# EAGLE design powerDist (EAGLE 6.6.0)
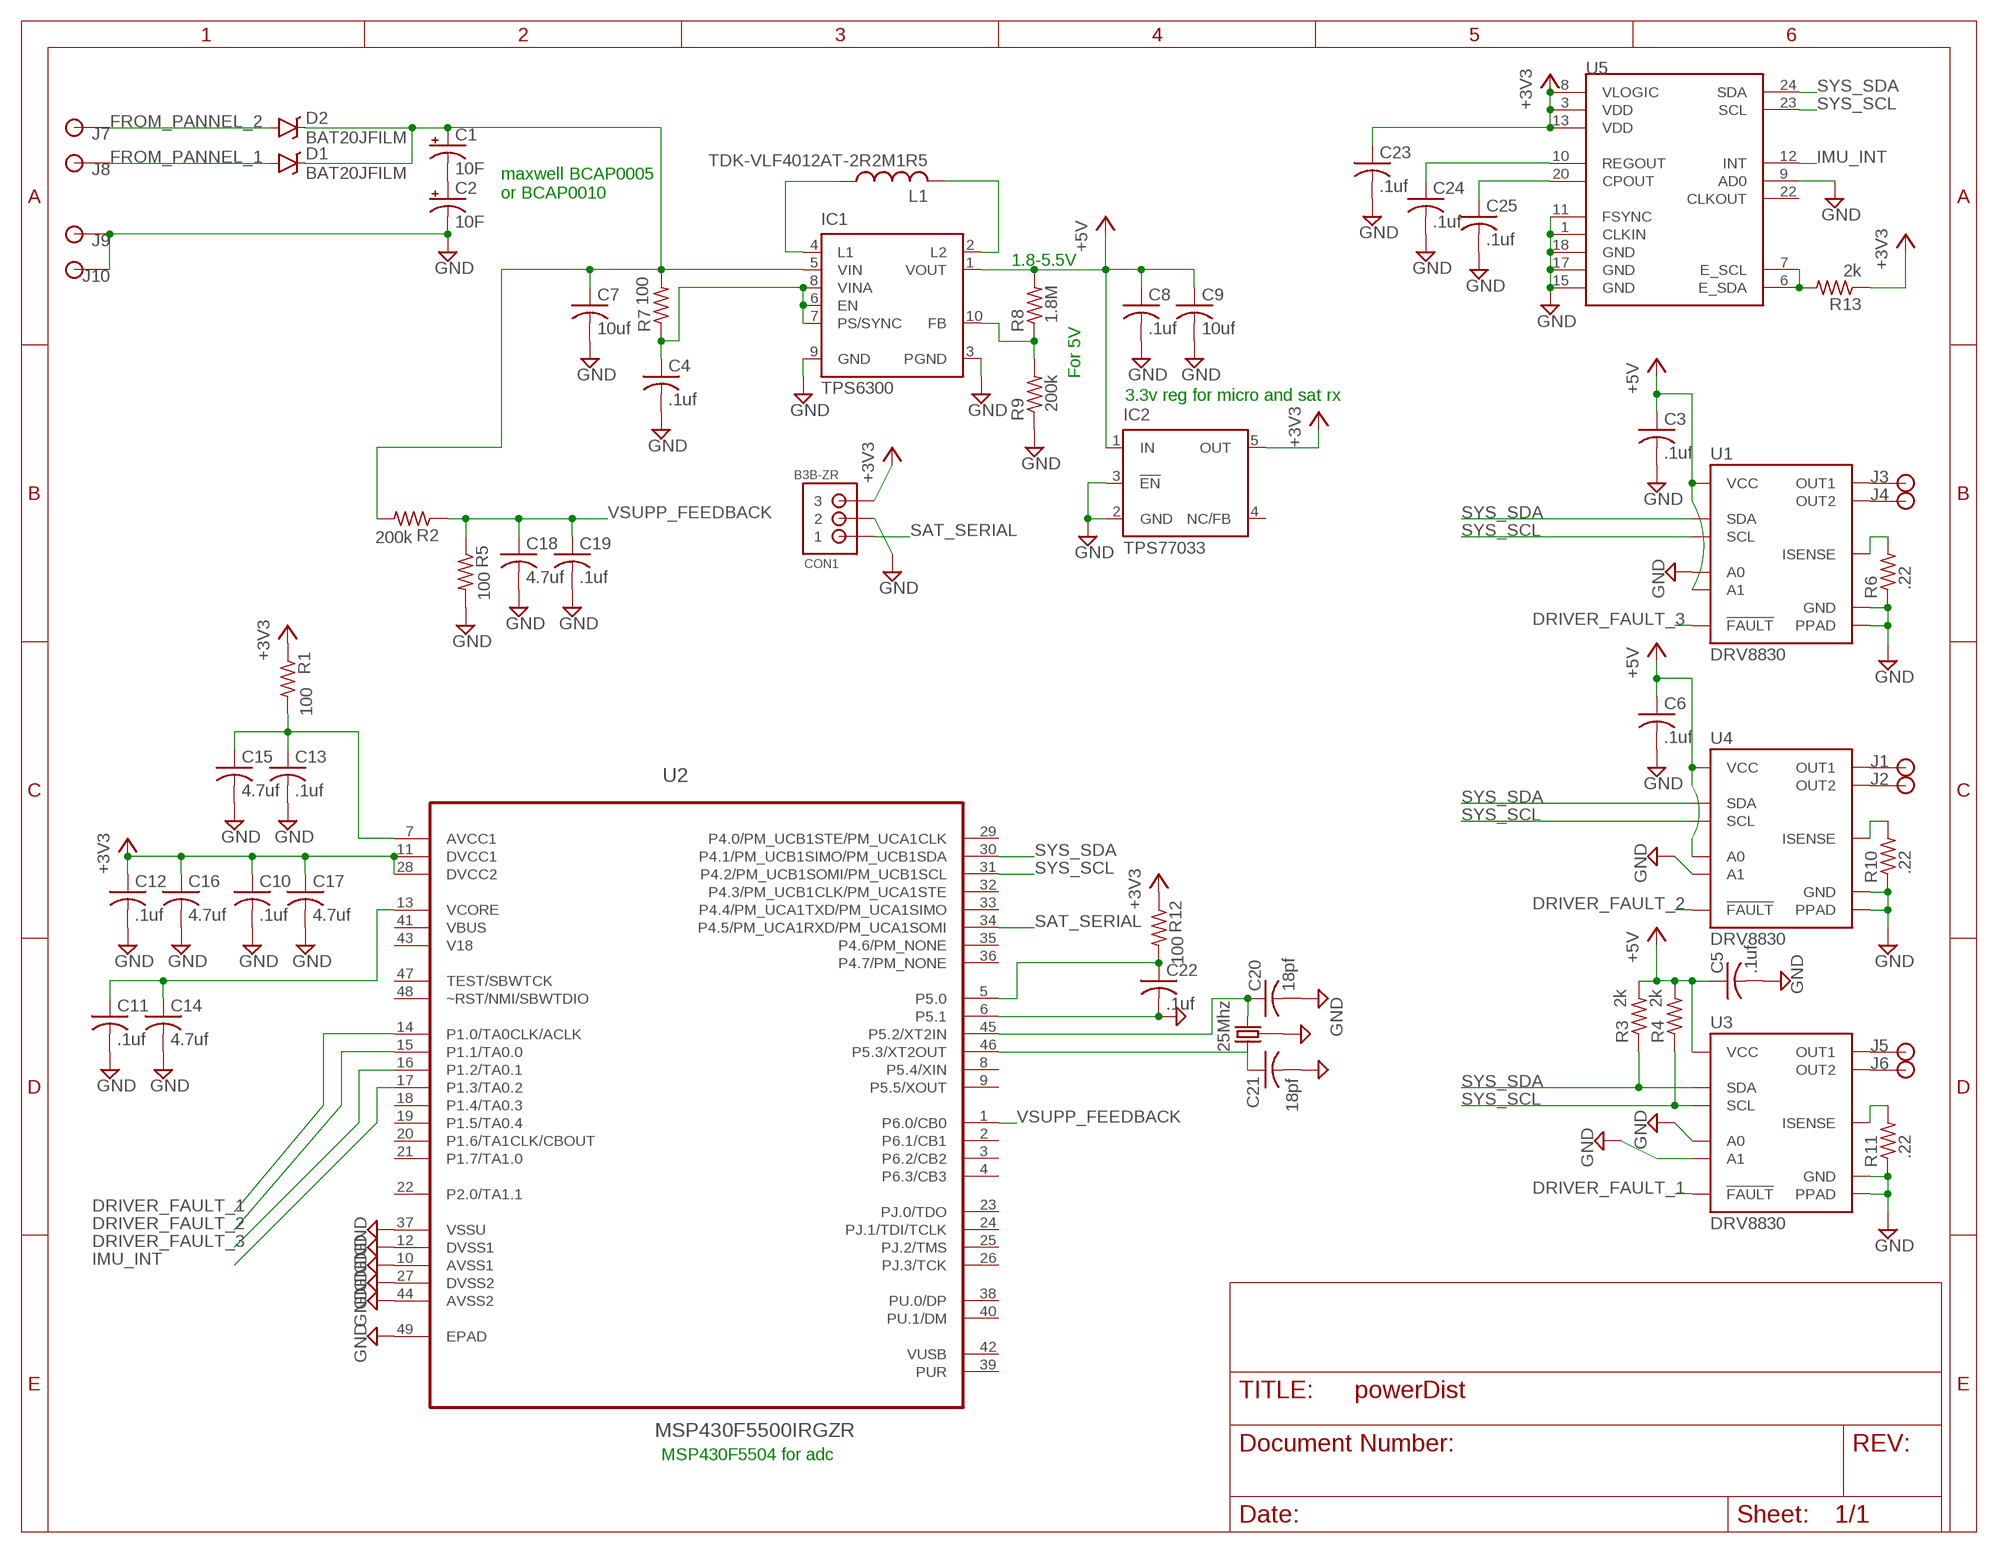
[diagram p0: schematic, sheet 1]

## Parts
C1  10F  CPOL-USE5-10.5  [E5-10,5]
C2  10F  CPOL-USE5-10.5  [E5-10,5]
C3  .1uf  C-USC0603  [C0603]
C4  .1uf  C-USC0603  [C0603]
C5  .1uf  C-USC0603  [C0603]
C6  .1uf  C-USC0603  [C0603]
C7  10uf  C-USC0603  [C0603]
C8  .1uf  C-USC0603  [C0603]
C9  10uf  C-USC0603  [C0603]
C10  .1uf  C-USC0603  [C0603]
C11  .1uf  C-USC0603  [C0603]
C12  .1uf  C-USC0603  [C0603]
C13  .1uf  C-USC0603  [C0603]
C14  4.7uf  C-USC0603  [C0603]
C15  4.7uf  C-USC0603  [C0603]
C16  4.7uf  C-USC0603  [C0603]
C17  4.7uf  C-USC0603  [C0603]
C18  4.7uf  C-USC0603  [C0603]
C19  .1uf  C-USC0603  [C0603]
C20  18pf  C-USC0603  [C0603]
C21  18pf  C-USC0603  [C0603]
C22  .1uf  C-USC0603  [C0603]
C23  .1uf  C-USC0603  [C0603]
C24  .1uf  C-USC0603  [C0603]
C25  .1uf  C-USC0603  [C0603]
CON1  B3B-ZR  [B3B-ZR]
D1  BAT20JFILM  [SOD-323]
D2  BAT20JFILM  [SOD-323]
IC1  TPS6300  [DRC-S-PVSON-N10]
IC2  TPS77033  [SOT23-DBV]
J1  2MMPAD  [2MMPAD]
J2  2MMPAD  [2MMPAD]
J3  2MMPAD  [2MMPAD]
J4  2MMPAD  [2MMPAD]
J5  2MMPAD  [2MMPAD]
J6  2MMPAD  [2MMPAD]
J7  2MMPAD  [2MMPAD]
J8  2MMPAD  [2MMPAD]
J9  2MMPAD  [2MMPAD]
J10  2MMPAD  [2MMPAD]
L1  TDK-VLF4012AT-2R2M1R5  [TDK-VLF4012AT-2R2M1R5]
Q1  25Mhz  CRYSTAL-GROUNDED  [CRYSTAL-SMD-5X3]
R1  100  R-US_R0402  [R0402]
R2  200k  R-US_R0402  [R0402]
R3  2k  R-US_R0402  [R0402]
R4  2k  R-US_R0402  [R0402]
R5  100  R-US_R0402  [R0402]
R6  .22  R-US_R0402  [R0402]
R7  100  R-US_R0402  [R0402]
R8  1.8M  R-US_R0402  [R0402]
R9  200k  R-US_R0402  [R0402]
R10  .22  R-US_R0402  [R0402]
R11  .22  R-US_R0402  [R0402]
R12  100  R-US_R0402  [R0402]
R13  2k  R-US_R0402  [R0402]
U1  DRV8830  [MSOP-10-GNDPAD]
U2  MSP430F5500IRGZR  [QFN50P700X700X100-49N]
U3  DRV8830  [MSOP-10-GNDPAD]
U4  DRV8830  [MSOP-10-GNDPAD]
U5  MPU-9150QFN-24-NP  [QFN-24-NP]

## Nets
+3V3: C10.1 C12.1 C16.1 C17.1 C23.1 CON1.3 IC2.5(OUT) R1.1 R12.1 R13.1 U2.11(DVCC1) U2.28(DVCC2) U5.3(VDD) U5.8(VLOGIC) U5.13(VDD)
+5V: C3.1 C5.1 C6.1 C8.1 C9.1 IC1.1(VOUT) IC2.1(IN) R3.2 R4.2 R8.2 U1.4(VCC) U1.8(A1) U3.4(VCC) U4.4(VCC) U4.7(A0)
DRIVER_FAULT_1: U2.14(P1.0/TA0CLK/ACLK) U3.6(!FAULT)
DRIVER_FAULT_2: U2.15(P1.1/TA0.0) U4.6(!FAULT)
DRIVER_FAULT_3: U1.6(!FAULT) U2.16(P1.2/TA0.1)
FROM_PANNEL_1: D1.A J8.P$1
FROM_PANNEL_2: D2.A J7.P$1
GND: C2.- C3.2 C4.2 C5.2 C6.2 C7.2 C8.2 C9.2 C10.2 C11.2 C12.2 C13.2 C14.2 C15.2 C16.2 C17.2 C18.2 C19.2 C20.2 C21.2 C22.2 C23.2 C24.2 C25.2 CON1.2 IC1.3(PGND) IC1.9(GND) IC2.2(GND) IC2.3(!EN) J9.P$1 J10.P$1 Q1.2 Q1.4 R5.2 R6.1 R9.1 R10.1 R11.1 U1.5(GND) U1.7(A0) U1.GND(PPAD) U2.6(P5.1) U2.10(AVSS1) U2.12(DVSS1) U2.27(DVSS2) U2.37(VSSU) U2.44(AVSS2) U2.49(EPAD) U3.5(GND) U3.7(A0) U3.8(A1) U3.GND(PPAD) U4.5(GND) U4.8(A1) U4.GND(PPAD) U5.1(CLKIN) U5.9(AD0) U5.11(FSYNC) U5.15(GND) U5.17(GND) U5.18(GND)
IMU_INT: U2.17(P1.3/TA0.2) U5.12(INT)
N$1: C1.- C2.+
N$2: C1.+ C7.1 D1.C D2.C IC1.5(VIN) R2.2 R7.2
N$3: IC1.4(L1) L1.P$1
N$4: IC1.2(L2) L1.P$2
N$5: C13.1 C15.1 R1.2 U2.7(AVCC1)
N$6: J1.P$1 U4.3(OUT1)
N$7: C11.1 C14.1 U2.13(VCORE)
N$8: C4.1 IC1.6(EN) IC1.7(PS/SYNC) IC1.8(VINA) R7.1
N$9: IC1.10(FB) R8.1 R9.2
N$10: J2.P$1 U4.1(OUT2)
N$11: J3.P$1 U1.3(OUT1)
N$12: J4.P$1 U1.1(OUT2)
N$13: J5.P$1 U3.3(OUT1)
N$14: J6.P$1 U3.1(OUT2)
N$15: C20.1 Q1.1 U2.45(P5.2/XT2IN)
N$16: C21.1 Q1.3 U2.46(P5.3/XT2OUT)
N$17: R6.2 U1.2(ISENSE)
N$18: R11.2 U3.2(ISENSE)
N$19: R10.2 U4.2(ISENSE)
N$20: C22.1 R12.2 U2.5(P5.0)
N$21: R13.2 U5.6(E_SDA) U5.7(E_SCL)
N$22: C24.1 U5.10(REGOUT)
N$23: C25.1 U5.20(CPOUT)
SAT_SERIAL: CON1.1 U2.34(P4.5/PM_UCA1RXD/PM_UCA1SOMI)
SYS_SCL: R4.1 U1.10(SCL) U2.31(P4.2/PM_UCB1SOMI/PM_UCB1SCL) U3.10(SCL) U4.10(SCL) U5.23(SCL)
SYS_SDA: R3.1 U1.9(SDA) U2.30(P4.1/PM_UCB1SIMO/PM_UCB1SDA) U3.9(SDA) U4.9(SDA) U5.24(SDA)
VSUPP_FEEDBACK: C18.1 C19.1 R2.1 R5.1 U2.1(P6.0/CB0)
Unconnected: IC1.TH IC2.4(NC/FB) U2.2(P6.1/CB1) U2.3(P6.2/CB2) U2.4(P6.3/CB3) U2.8(P5.4/XIN) U2.9(P5.5/XOUT) U2.18(P1.4/TA0.3) U2.19(P1.5/TA0.4) U2.20(P1.6/TA1CLK/CBOUT) U2.21(P1.7/TA1.0) U2.22(P2.0/TA1.1) U2.23(PJ.0/TDO) U2.24(PJ.1/TDI/TCLK) U2.25(PJ.2/TMS) U2.26(PJ.3/TCK) U2.29(P4.0/PM_UCB1STE/PM_UCA1CLK) U2.32(P4.3/PM_UCB1CLK/PM_UCA1STE) U2.33(P4.4/PM_UCA1TXD/PM_UCA1SIMO) U2.35(P4.6/PM_NONE) U2.36(P4.7/PM_NONE) U2.38(PU.0/DP) U2.39(PUR) U2.40(PU.1/DM) U2.41(VBUS) U2.42(VUSB) U2.47(TEST/SBWTCK) U2.48(~RST/NMI/SBWTDIO) U5.22(CLKOUT)

## Notes on the sheet
- maxwell BCAP0005 
  or BCAP0010
- 1.8-5.5V
- For 5V
- 3.3v reg for micro and sat rx
- MSP430F5504 for adc

## Power pins joined to a net without a drawn wire
V18: U2.43(V18)

## Library data of the parts
C1 C2 = rcl:CPOL-US: POLARIZED CAPACITOR, American symbol
C3-C25 = rcl:C-US: CAPACITOR, American symbol
CON1 = jst:B3B-ZR: JST-ZH Connector 3 pol, 1.5mm pitch Package: B3B-ZR Source: http://www.jst-mfg.com/product/pdf/eng/eZH.pdf
D1 D2 = SparkFun-DiscreteSemi:BAT20JFILM: 23V, 1A Schottky diode, SOD-323 package; PROD_ID: DIO-11623
IC1 = texas:TPS6300*: HIGH EFFICIENT SINGLE INDUCTOR BUCK-BOOST CONVERTER WITH 1.8-A SWITCHES Source: http://focus.ti.com/lit/ds/symlink/tps63001.pdf; MPN: TPS63000DRCTG4; OC_FARNELL: 1511852; OC_NEWARK: 59M7217
IC2 = texas:TPS770*: ULTRALOW-POWER 50-mA LOW-DROPOUT LINEAR REGULATORS 50-mA Low-Dropout Regulator Source: http://focus.ti.com/lit/ds/symlink/tps77001.pdf; MF: TEXAS INSTRUMENTS; MPN: TPS77033DBVT; OC_FARNELL: 8461570; OC_NEWARK: 77C1187
J1-J10 = connectors:2MMPAD
L1 = passives:TDK-VLF4012AT-2R2M1R5; MFG: TDK; MFN: VLF4012AT-2R2M1R5
Q1 = SparkFun-FreqCtrl:CRYSTAL-GROUNDED
R1-R13 = rcl:R-US_: RESISTOR, American symbol
U1 U3 U4 = SparkFun-PowerIC:DRV8830: DRV8830 I2C DC Motor Driver TSSOP-10 with exposed power pad 1A current limit, 2.75V to 6.8V; PROD_ID: IC-11646
U2 = Texas Instruments_By_element14_Batch_1:MSP430F5500IRGZR: MIXED SIGNAL MICROCONTROLLER; MPN: MSP430F5500IRGZR; OC_FARNELL: 1972383; OC_NEWARK: 27T6606; PACKAGE: VQFN-48; SUPPLIER: TEXAS INSTRUMENTS
U5 = SparkFun-Sensors:MPU-9150: 9DOF (3mag, 3accel, 3rotat). I2C interface.

## Board
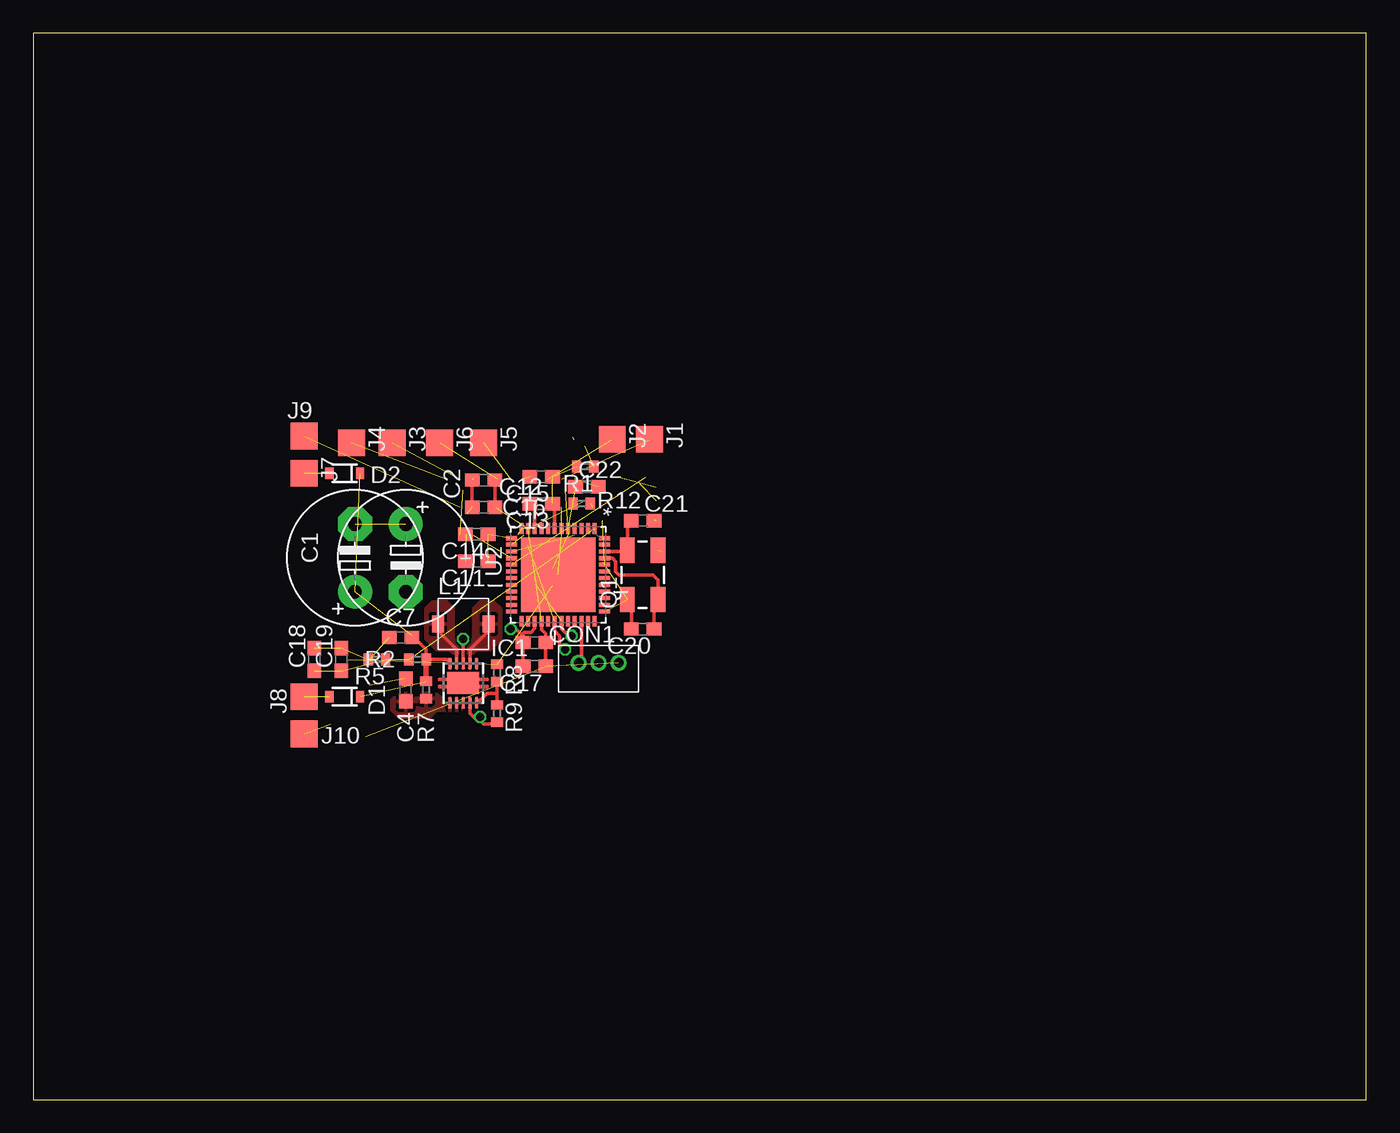
[diagram p1: board, top side]
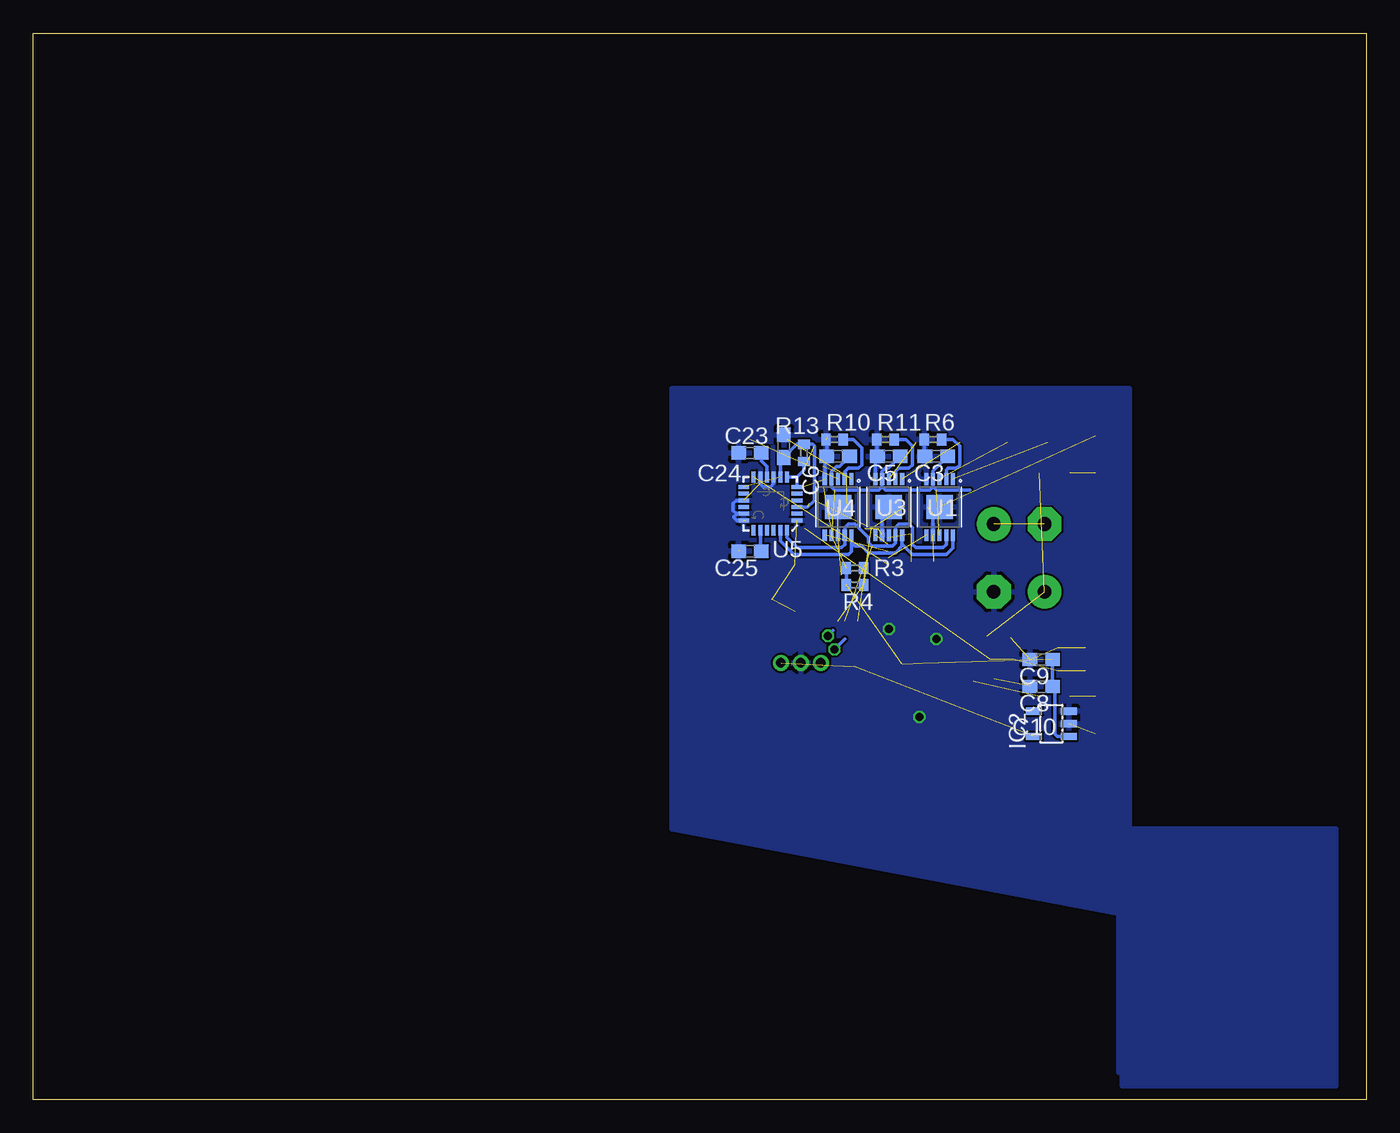
[diagram p2: board, bottom side, seen from below]

Size 100 x 80 mm. Coordinates in mm from the lower left corner, seen from the top.
Outline: 0,0 100,0 100,80 0,80 0,0
Copper layers (1*16): Top 0.035mm / dielectric 1.5mm / Bottom 0.035mm
Design rules "SeeedStudio_2layer_DRU_no_angle_20140221": minimum track width 6mil, minimum drill 12mil, track to track 6mil, track to pad 6mil, pad to pad 6mil, via to via 6mil, smd to smd 0mil, copper to edge 10mil, drill to drill 10mil, minimum pad ring 10mil, minimum via ring 6mil, stop-mask expansion 2mil, vias tented up to drill 100mil, thermal gap 10mil

### Footprints (pad centres in the part's own frame; a part is rotated, then mirrored left to right if it is on the bottom)
E5-10,5 = drill 1.016 pad 2.54: + -2.54,0 | drill 1.016 pad 2.54 octagon: - 2.54,0
C0603 = smd 1.1 x 1: 1 -0.85,0; 2 0.85,0
B3B-ZR = drill 0.7 pad 1.1: 1 -1.5,0; 2 0,0; 3 1.5,0
SOD-323 = smd 0.63 x 0.83: A 1.15,0; C -1.15,0
DRC-S-PVSON-N10 = smd 0.28 x 0.85: 1 -1,-1.475; 2 -0.5,-1.475; 3 0,-1.475; 4 0.5,-1.475; 5 1,-1.475; 6 1,1.475; 7 0.5,1.475; 8 0,1.475; 9 -0.5,1.475; 10 -1,1.475 | smd 2.4 x 1.65: TH 0,0
SOT23-DBV = smd 0.55 x 1.2: 1 -0.95,-1.3; 2 0,-1.3; 3 0.95,-1.3; 4 0.95,1.3; 5 -0.95,1.3
2MMPAD = smd 2 x 2: P$1 0,0
TDK-VLF4012AT-2R2M1R5 = smd 0.9 x 1.3: P$1 -1.9,0; P$2 1.9,0
CRYSTAL-SMD-5X3 = smd 1.9 x 1.1: 1 -1.85,-1.15; 2 1.85,-1.15; 3 1.85,1.15; 4 -1.85,1.15
R0402 = smd 0.7 x 0.9: 1 -0.65,0; 2 0.65,0
MSOP-10-GNDPAD = smd 0.305 x 0.889: 1 -1,-2.11; 2 -0.5,-2.11; 3 0,-2.11; 4 0.5,-2.11; 5 1,-2.11; 6 1,2.11; 7 0.5,2.11; 8 0,2.11; 9 -0.5,2.11; 10 -1,2.11 | smd 2 x 1.8: GND 0,0
QFN50P700X700X100-49N = smd 0.813 x 0.305: 1 -3.48,2.743; 2 -3.48,2.261; 3 -3.48,1.753; 4 -3.48,1.245; 5 -3.48,0.762; 6 -3.48,0.254; 7 -3.48,-0.254; 8 -3.48,-0.762; 9 -3.48,-1.245; 10 -3.48,-1.753; 11 -3.48,-2.261; 12 -3.48,-2.743; 25 3.48,-2.743; 26 3.48,-2.261; 27 3.48,-1.753; 28 3.48,-1.245; 29 3.48,-0.762; 30 3.48,-0.254; 31 3.48,0.254; 32 3.48,0.762; 33 3.48,1.245; 34 3.48,1.753; 35 3.48,2.261; 36 3.48,2.743 | smd 0.305 x 0.813: 13 -2.743,-3.48; 14 -2.261,-3.48; 15 -1.753,-3.48; 16 -1.245,-3.48; 17 -0.762,-3.48; 18 -0.254,-3.48; 19 0.254,-3.48; 20 0.762,-3.48; 21 1.245,-3.48; 22 1.753,-3.48; 23 2.261,-3.48; 24 2.743,-3.48; 37 2.743,3.48; 38 2.261,3.48; 39 1.753,3.48; 40 1.245,3.48; 41 0.762,3.48; 42 0.254,3.48; 43 -0.254,3.48; 44 -0.762,3.48; 45 -1.245,3.48; 46 -1.753,3.48; 47 -2.261,3.48; 48 -2.743,3.48 | smd 5.588 x 5.588: 49 0,0
QFN-24-NP = smd 0.8 x 0.3: 1 -2,1.25; 2 -2,0.75; 3 -2,0.25; 4 -2,-0.25; 5 -2,-0.75; 6 -2,-1.25; 13 2,-1.25; 14 2,-0.75; 15 2,-0.25; 16 2,0.25; 17 2,0.75; 18 2,1.25 | smd 0.3 x 0.8: 7 -1.25,-2; 8 -0.75,-2; 9 -0.25,-2; 10 0.25,-2; 11 0.75,-2; 12 1.25,-2; 19 1.25,2; 20 0.75,2; 21 0.25,2; 22 -0.25,2; 23 -0.75,2; 24 -1.25,2

### Placement (x,y rotation side)
C1  24.13,40.64 90 top
C2  27.94,40.64 270 top
C3  32.26,48.26 180 bottom
C4  27.94,30.73 90 top
C5  35.81,48.26 180 bottom
C6  39.62,48.26 180 bottom
C7  27.56,34.67 180 top
C8  24.38,30.99 180 bottom
C9  24.38,33.02 180 bottom
C10  37.59,34.29 180 top
C11  33.27,40.39 180 top
C12  33.78,46.48 180 top
C13  38.1,44.7 180 top
C14  33.27,42.42 180 top
C15  38.1,46.74 180 top
C16  33.78,44.45 180 top
C17  37.59,32.51 180 top
C18  21.08,33.02 90 top
C19  23.11,33.02 90 top
C20  45.72,35.31 180 top
C21  45.72,43.43 0 top
C22  41.53,45.97 0 top
C23  43.69,49.02 90 bottom
C24  46.23,48.51 180 bottom
C25  46.23,41.15 180 bottom
CON1  42.42,32.77 0 top
D1  23.37,30.23 180 top
D2  23.37,46.99 180 top
IC1  32.26,31.24 180 top
IC2  23.62,28.19 90 bottom
J1  46.23,49.53 270 top
J2  43.43,49.53 270 top
J3  26.92,49.28 270 top
J4  23.88,49.28 270 top
J5  33.78,49.28 270 top
J6  30.48,49.28 270 top
J7  20.32,46.99 270 top
J8  20.32,30.23 90 top
J9  20.32,49.78 0 top
J10  20.32,27.43 90 top
L1  32.26,35.69 0 top
Q1  45.72,39.37 90 top
R1  41.4,47.5 180 top
R2  28.83,33.02 0 top
R3  38.35,39.88 180 bottom
R4  38.35,38.61 180 bottom
R5  25.78,33.02 180 top
R6  32.51,49.53 0 bottom
R7  29.46,30.73 90 top
R8  34.8,32 90 top
R9  34.8,28.96 90 top
R10  39.88,49.53 0 bottom
R11  36.07,49.53 0 bottom
R12  41.15,44.7 180 top
R13  42.16,48.51 270 bottom
U1  32,44.45 180 bottom
U2  39.37,39.37 270 top
U3  35.81,44.45 180 bottom
U4  39.62,44.45 180 bottom
U5  44.7,44.7 180 bottom

### Tracks (layer width: path | path; a pad name or v marks a point on that pad's centre or on a via)
+3V3  (8 unrouted)
  Top 0.254: C17.1 C10.1 38.44,34.96 38.12,35.28 U2.28 | C16.1 C12.1
  Bottom 0.254: U5.8 43.95,47.91 C23.1 42.7,49.16 R13.1 41.54,49.16 41.4,49.02 41.4,44.96 41.91,44.45 U5.3
+5V  (6 unrouted)
  Top 0.254: 34.84,32.7 R8.2
  Bottom 0.254: IC2.1 23.18,27.24 23.37,27.43 23.37,30.82 C8.1 C9.1 | R4.2 R3.2 | C3.1 32.5,47.16 U1.4 32.5,45.97 | 32.5,45.97 32.26,45.72 29.72,45.72 | 36.31,45.97 U3.4 36.31,47.12 36.07,47.37 35.85,47.37 C5.1 | 36.31,45.97 36.07,45.72 32.75,45.72 32.5,45.97 | 36.31,45.97 36.56,45.72 39.88,45.72 40.12,45.97 U4.4 40.12,47.12 39.75,47.5 39.54,47.5 C6.1
DRIVER_FAULT_1  (1 unrouted)
DRIVER_FAULT_2  (1 unrouted)
DRIVER_FAULT_3  (1 unrouted)
FROM_PANNEL_1  (1 unrouted)
FROM_PANNEL_2  (1 unrouted)
GND  (via drill 0.6)  (25 unrouted)
  Top 0.254: IC1.3 v32.26,34.54 | R9.1 34.8,28.19 33.78,28.19 33.53,28.45 v33.53,28.7 33.02,28.7 32.76,28.96 IC1.9 | C17.2 C10.2 | C10.2 36.74,34.38 | U2.27 37.62,35.33 37.34,35.05 36.83,35.05 36.74,34.96 36.74,34.8 | C10.2 36.74,34.8 | v35.81,35.31 36.23,35.31 36.74,34.8 | C16.2 C12.2 | C20.2 44.87,37.22 Q1.4 | U2.10 37.62,44.34 C13.2
  Bottom 0.254: U5.15 47.25,44.95 47.5,44.7 47.5,44.2 47.26,43.95 | 47.26,43.95 U5.17 47.23,43.95 | U5.18 47.22,43.45 47.46,43.69 47.26,43.89 47.26,43.95 | v32.26,34.54 32,34.54 | C8.2 25.23,31.08 | C9.2 25.23,32.93 | U5.9 44.45,46.22 44.7,45.97 45.21,45.97 45.47,46.23 45.47,46.69 U5.11 | 40.39,49.78 40.47,49.7 C6.2 40.62,48.36 U4.5 | R6.1 33.16,48.06 C3.2 | R11.1 36.72,48.31 C5.2 36.81,48.11 U3.5 | U1.7 32.5,43.95 U1.GND | U3.7 36.31,43.95 U3.GND
  pour Bottom: 17.78,53.34 17.78,20.32 2.29,20.32 2.29,1.02 18.29,1.02 18.29,2.03 18.54,2.03 18.54,13.97 52.07,20.32 52.07,53.34
IMU_INT  (1 unrouted)
N$1  (1 unrouted)
N$2  (3 unrouted)
  Top 0.254: C7.1 28.45,34.8 29.46,33.78 29.46,33.02 R2.2 30.99,33.02 31.24,32.77 IC1.5
  Top 0.406: 29.46,33.02 R7.2
N$3
  Top 0.254: IC1.4 31.75,32.77 31.75,33.78 30.48,35.05 30.48,35.56 L1.P$1
  pour Top: 31.75,33.27 31.24,33.78 30.23,33.78 29.46,34.54 29.46,36.83 29.97,37.34 30.99,37.34 31.5,36.83 31.5,34.54 32,34.04 32,33.53
N$4
  Top 0.254: IC1.2 32.77,32.77 32.77,33.78 34.04,35.05 34.04,35.56 L1.P$2
  pour Top: 32.77,33.27 33.27,33.78 34.29,33.78 35.05,34.54 35.05,36.83 34.54,37.34 33.53,37.34 33.02,36.83 33.02,34.54 32.51,34.04 32.51,33.53
N$5  (2 unrouted)
  Top 0.254: U2.7 39.12,44.54 C13.1
N$6  (1 unrouted)
N$7  (2 unrouted)
N$8
  pour Top: 32.26,29.46 32.26,29.97 30.73,29.97 30.23,30.48 27.43,30.48 26.92,29.97 26.92,29.21 27.43,28.7 29.72,28.7 30.23,29.21 32,29.21
N$9
  Top 0.254: 34.8,30.48 34.04,30.48 33.27,29.72 IC1.10 | 34.8,30.48 R9.2 | 34.8,30.48 R8.1
N$10  (1 unrouted)
N$11  (1 unrouted)
N$12  (1 unrouted)
N$13  (1 unrouted)
N$14  (1 unrouted)
N$15
  Top 0.254: U2.45 43.46,40.62 43.69,40.39 43.69,39.62 43.94,39.37 46.48,39.37 46.87,38.98 Q1.1 46.57,37.22 C20.1
N$16
  Top 0.254: U2.46 44.47,41.12 Q1.3 44.57,43.13 C21.1
N$17
  Bottom 0.254: U1.2 31.5,47.24 31.37,47.37 30.73,47.37 30.48,47.62 30.48,49.02 30.99,49.53 R6.2
N$18
  Bottom 0.254: U3.2 35.31,47.11 35.05,47.37 34.29,47.37 34.04,47.62 34.04,49.02 34.54,49.53 R11.2
N$19
  Bottom 0.254: U4.2 39.12,47.11 38.86,47.37 38.1,47.37 37.85,47.62 37.85,48.9 38.48,49.53 R10.2
N$20  (2 unrouted)
N$21
  Bottom 0.254: R13.2 42.16,47.24 42.7,46.7 | U5.6 42.7,46.7 | U5.7 42.7,46.7
N$22
  Bottom 0.254: U5.10 44.95,47.49 45.38,47.92 C24.1
N$23
  Bottom 0.254: U5.20 45.45,41.22 C25.1
SAT_SERIAL
  Top 0.254: U2.34 41.12,32.97 CON1.1
SYS_SCL  (via drill 0.6)  (2 unrouted)
  Top 0.254: U2.31 39.62,35.31 39.88,35.05 40.13,35.05 v40.39,34.8
  Bottom 0.254: 39.99,35.19 v40.39,34.8 | 38.61,42.33 U4.10 | U4.10 38.62,41.8 38.35,41.53 37.85,41.53 37.34,41.02 35.31,41.02 34.81,41.51 34.81,41.67 | U4.10 38.62,41.13 38.86,40.89 42.93,40.89 43.95,41.92 U5.23 | U1.10 31,41.39 31.5,40.89 34.04,40.89 34.81,41.67 | U3.10 34.81,41.67
SYS_SDA  (via drill 0.6)  (2 unrouted)
  Top 0.254: U2.30 39.12,35.18 39.5,34.8 39.5,34.16 v39.88,33.78
  Bottom 0.254: 39.12,34.54 v39.88,33.78 | U1.9 31.5,41.65 31.75,41.4 33.78,41.4 34.04,41.66 34.04,42.93 34.29,43.18 35.05,43.18 35.31,42.92 U3.9 35.31,41.77 35.56,41.53 37.08,41.53 37.34,41.78 37.34,42.16 38.35,43.18 38.86,43.18 39.12,42.92 U4.9 39.12,41.66 39.37,41.4 42.67,41.4 43.45,42.18 U5.24
VSUPP_FEEDBACK  (4 unrouted)